# Altium project 微断从V2.0.PrjPcb
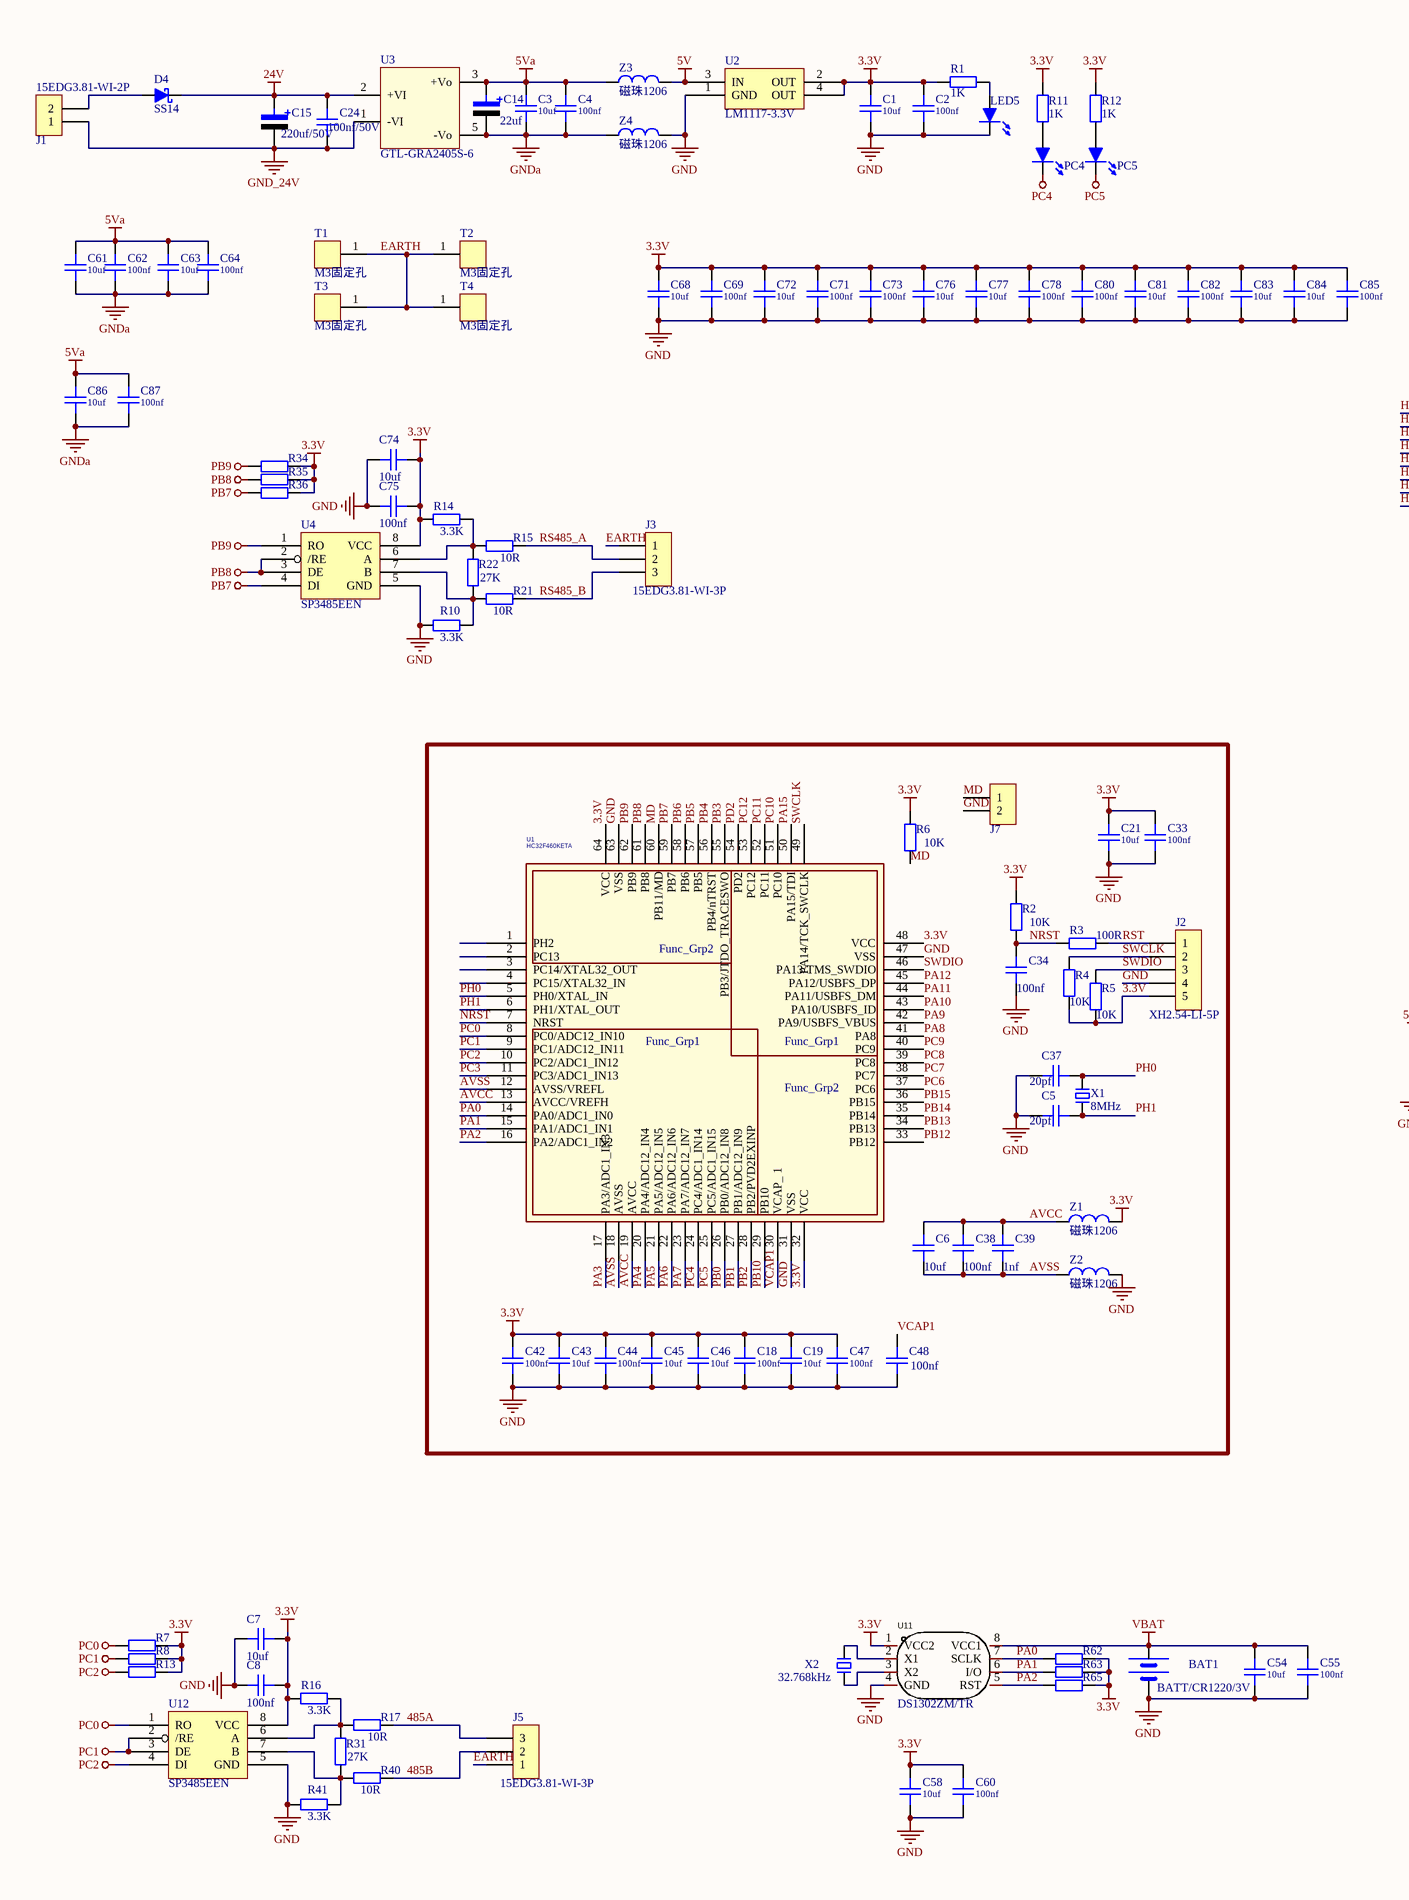
[diagram p0: 微断从V2.0.SchDoc, left]
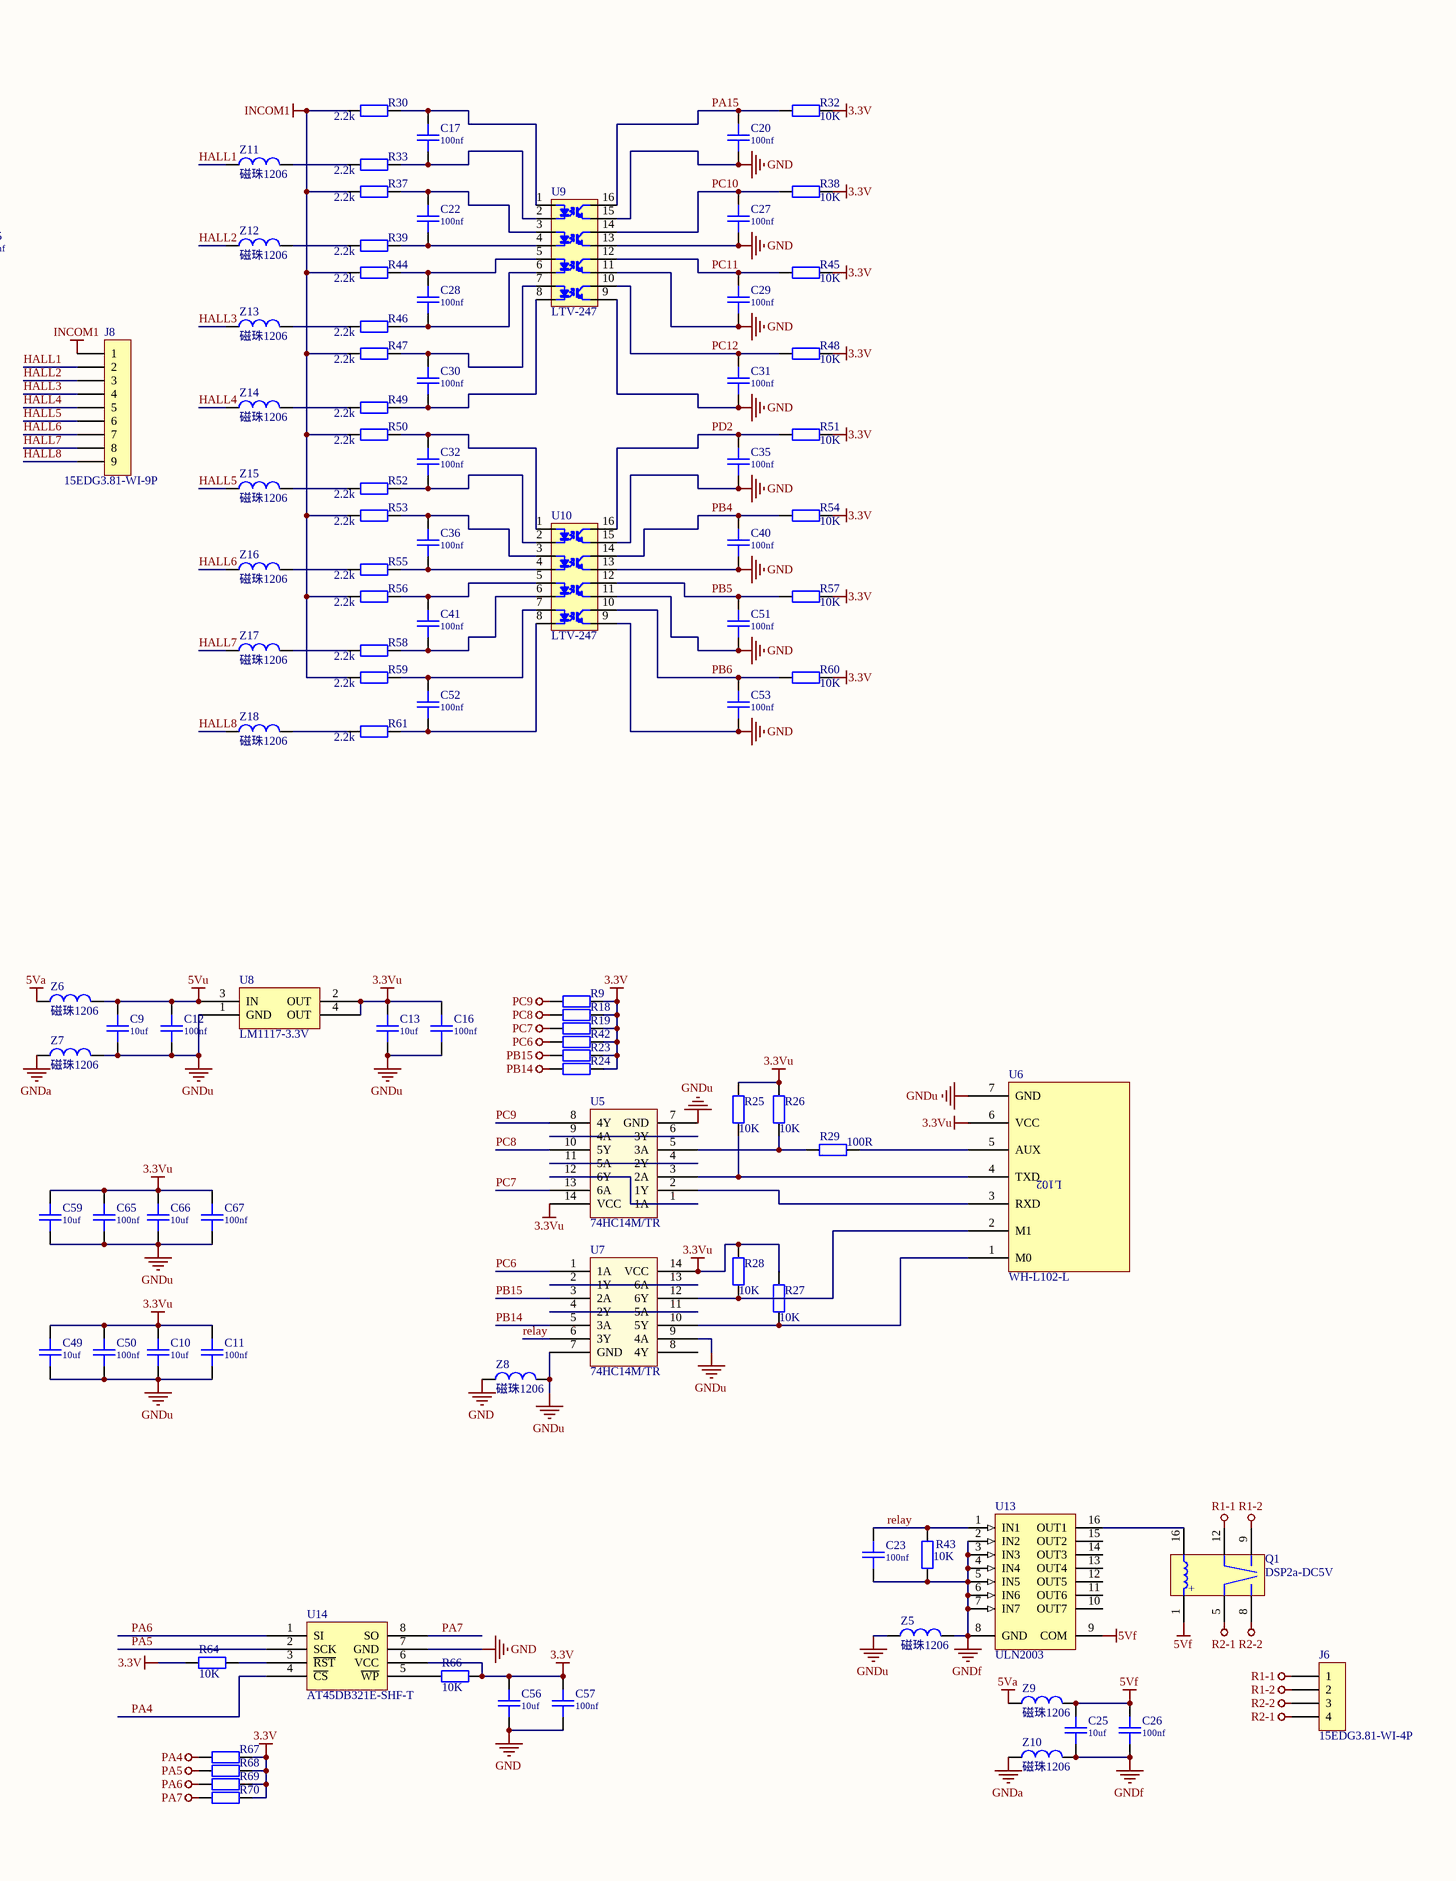
[diagram p1: 微断从V2.0.SchDoc, right]
1 sheet, 205 parts. Net scope: global (net labels, ports and power ports of the same name join across sheets).
Board file: 微断从V2.0.PcbDoc

## Sheet 微断从V2.0.SchDoc
size A2

### Parts
BAT1  BATT/CR1220/3V  [CR1220_A]
C1  10uf  [0805-C]
C2  100nf  [0603-C]
C3  10uf  [0805-C]
C4  100nf  [0603-C]
C5  20pf  [0603-C]
C6  10uf  [0805-C]
C7  10uf  [0805-C]
C8  100nf  [0603-C]
C9  10uf  [0805-C]
C10  10uf  [0805-C]
C11  100nf  [0603-C]
C12  100nf  [0603-C]
C13  10uf  [0805-C]
C14  22uf  [CD B(3528)]
C15  220uf/50V  [CAP 3.5*8*11.5 - BK]
C16  100nf  [0603-C]
C17  100nf  [0603-C]
C18  100nf  [0603-C]
C19  10uf  [0805-C]
C20  100nf  [0603-C]
C21  10uf  [0805-C]
C22  100nf  [0603-C]
C23  100nf  [0603-C]
C24  100nf/50V  [0603-C]
C25  10uf  [0805-C]
C26  100nf  [0603-C]
C27  100nf  [0603-C]
C28  100nf  [0603-C]
C29  100nf  [0603-C]
C30  100nf  [0603-C]
C31  100nf  [0603-C]
C32  100nf  [0603-C]
C33  100nf  [0603-C]
C34  100nf  [0603-C]
C35  100nf  [0603-C]
C36  100nf  [0603-C]
C37  20pf  [0603-C]
C38  100nf  [0603-C]
C39  1nf  [0603-C]
C40  100nf  [0603-C]
C41  100nf  [0603-C]
C42  100nf  [0603-C]
C43  10uf  [0805-C]
C44  100nf  [0603-C]
C45  10uf  [0805-C]
C46  10uf  [0805-C]
C47  100nf  [0603-C]
C48  100nf  [0603-C]
C49  10uf  [0805-C]
C50  100nf  [0603-C]
C51  100nf  [0603-C]
C52  100nf  [0603-C]
C53  100nf  [0603-C]
C54  10uf  [0805-C]
C55  100nf  [0603-C]
C56  10uf  [0805-C]
C57  100nf  [0603-C]
C58  10uf  [0805-C]
C59  10uf  [0805-C]
C60  100nf  [0603-C]
C61  10uf  [0805-C]
C62  100nf  [0603-C]
C63  10uf  [0805-C]
C64  100nf  [0603-C]
C65  100nf  [0603-C]
C66  10uf  [0805-C]
C67  100nf  [0603-C]
C68  10uf  [0805-C]
C69  100nf  [0603-C]
C71  100nf  [0603-C]
C72  10uf  [0805-C]
C73  100nf  [0603-C]
C74  10uf  [0805-C]
C75  100nf  [0603-C]
C76  10uf  [0805-C]
C77  10uf  [0805-C]
C78  100nf  [0603-C]
C80  100nf  [0603-C]
C81  10uf  [0805-C]
C82  100nf  [0603-C]
C83  10uf  [0805-C]
C84  10uf  [0805-C]
C85  100nf  [0603-C]
C86  10uf  [0805-C]
C87  100nf  [0603-C]
D4  SS14  [SMA/DO-214AC]
J1  15EDG3.81-WI-2P  [15EDG3.81-WI-2P]
J2  XH2.54-LI-5P  [XH2.54-LI-5P]
J3  15EDG3.81-WI-3P  [15EDG3.81-WI-3P]
J5  15EDG3.81-WI-3P  [15EDG3.81-WI-3P]
J6  15EDG3.81-WI-4P  [15EDG3.81-WI-4P]
J7  排针1*2P  [HDR2X1_A]  (value not drawn)
J8  15EDG3.81-WI-9P  [15EDG3.81-WI-9P]
LED5  LED0603,黄绿  [0603-LED-G]  (value not drawn)
PC4  LED0603,黄绿  [0603-LED-G]  (value not drawn)
PC5  LED0603,黄绿  [0603-LED-G]  (value not drawn)
Q1  DSP2a-DC5V  [DSP2a-DC5V]
R1  1K  [0603-R]
R2  10K  [0603-R]
R3  100R  [0603-R]
R4  10K  [0603-R]
R5  10K  [0603-R]
R6  10K  [0603-R]
R7  10K  [0603-R]  (value not drawn)
R8  10K  [0603-R]  (value not drawn)
R9  10K  [0603-R]  (value not drawn)
R10  3.3K  [0603-R]
R11  1K  [0603-R]
R12  1K  [0603-R]
R13  10K  [0603-R]  (value not drawn)
R14  3.3K  [0603-R]
R15  10R  [0603-R]
R16  3.3K  [0603-R]
R17  10R  [0603-R]
R18  10K  [0603-R]  (value not drawn)
R19  10K  [0603-R]  (value not drawn)
R21  10R  [0603-R]
R22  27K  [0603-R]
R23  10K  [0603-R]  (value not drawn)
R24  10K  [0603-R]  (value not drawn)
R25  10K  [0603-R]
R26  10K  [0603-R]
R27  10K  [0603-R]
R28  10K  [0603-R]
R29  100R  [0603-R]
R30  2.2k  [0603-R]
R31  27K  [0603-R]
R32  10K  [0603-R]
R33  2.2k  [0603-R]
R34  10K  [0603-R]  (value not drawn)
R35  10K  [0603-R]  (value not drawn)
R36  10K  [0603-R]  (value not drawn)
R37  2.2k  [0603-R]
R38  10K  [0603-R]
R39  2.2k  [0603-R]
R40  10R  [0603-R]
R41  3.3K  [0603-R]
R42  10K  [0603-R]  (value not drawn)
R43  10K  [0603-R]
R44  2.2k  [0603-R]
R45  10K  [0603-R]
R46  2.2k  [0603-R]
R47  2.2k  [0603-R]
R48  10K  [0603-R]
R49  2.2k  [0603-R]
R50  2.2k  [0603-R]
R51  10K  [0603-R]
R52  2.2k  [0603-R]
R53  2.2k  [0603-R]
R54  10K  [0603-R]
R55  2.2k  [0603-R]
R56  2.2k  [0603-R]
R57  10K  [0603-R]
R58  2.2k  [0603-R]
R59  2.2k  [0603-R]
R60  10K  [0603-R]
R61  2.2k  [0603-R]
R62  10K  [0603-R]  (value not drawn)
R63  10K  [0603-R]  (value not drawn)
R64  10K  [0603-R]
R65  10K  [0603-R]  (value not drawn)
R66  10K  [0603-R]
R67  10K  [0603-R]  (value not drawn)
R68  10K  [0603-R]  (value not drawn)
R69  10K  [0603-R]  (value not drawn)
R70  10K  [0603-R]  (value not drawn)
T1  M3固定孔  [M3_N]
T2  M3固定孔  [M3_N]
T3  M3固定孔  [M3_N]
T4  M3固定孔  [M3_N]
U1  HC32F460KETA  [LQFP-64]
U2  LM1117-3.3V  [SOT223]
U3  GTL-GRA2405S-6  [GTL-GRA]
U4  SP3485EEN  [SOIC-8]
U5  74HC14M/TR  [SOIC-14]
U6  WH-L102-L  [WH-L102-L_Lib_V1.0]
U7  74HC14M/TR  [SOIC-14]
U8  LM1117-3.3V  [SOT223]
U9  LTV-247  [SOIC-16-9.1mm]
U10  LTV-247  [SOIC-16-9.1mm]
U11  DS1302ZM/TR  [SOIC-8]
U12  SP3485EEN  [SOIC-8]
U13  ULN2003  [SOIC-16]
U14  AT45DB321E-SHF-T  [SOIC-8-208mil]
X1  8MHz  [OSC HC-49SMD]
X2  32.768kHz  [OSC HC-49SMD]
Z1  value 磁珠1206  [1206-R-RP]  (hidden comment: 磁珠1206/SCBG321609U600T)
Z2  value 磁珠1206  [1206-R-RP]  (hidden comment: 磁珠1206/SCBG321609U600T)
Z3  value 磁珠1206  [1206-R-RP]  (hidden comment: 磁珠1206/SCBG321609U600T)
Z4  value 磁珠1206  [1206-R-RP]  (hidden comment: 磁珠1206/SCBG321609U600T)
Z5  value 磁珠1206  [1206-R-RP]  (hidden comment: 磁珠1206/SCBG321609U600T)
Z6  value 磁珠1206  [1206-R-RP]  (hidden comment: 磁珠1206/SCBG321609U600T)
Z7  value 磁珠1206  [1206-R-RP]  (hidden comment: 磁珠1206/SCBG321609U600T)
Z8  value 磁珠1206  [1206-R-RP]  (hidden comment: 磁珠1206/SCBG321609U600T)
Z9  value 磁珠1206  [1206-R-RP]  (hidden comment: 磁珠1206/SCBG321609U600T)
Z10  value 磁珠1206  [1206-R-RP]  (hidden comment: 磁珠1206/SCBG321609U600T)
Z11  value 磁珠1206  [1206-R-RP]  (hidden comment: 磁珠1206/SCBG321609U600T)
Z12  value 磁珠1206  [1206-R-RP]  (hidden comment: 磁珠1206/SCBG321609U600T)
Z13  value 磁珠1206  [1206-R-RP]  (hidden comment: 磁珠1206/SCBG321609U600T)
Z14  value 磁珠1206  [1206-R-RP]  (hidden comment: 磁珠1206/SCBG321609U600T)
Z15  value 磁珠1206  [1206-R-RP]  (hidden comment: 磁珠1206/SCBG321609U600T)
Z16  value 磁珠1206  [1206-R-RP]  (hidden comment: 磁珠1206/SCBG321609U600T)
Z17  value 磁珠1206  [1206-R-RP]  (hidden comment: 磁珠1206/SCBG321609U600T)
Z18  value 磁珠1206  [1206-R-RP]  (hidden comment: 磁珠1206/SCBG321609U600T)

### Blocks framed on the sheet
Func_Grp1: U1

### Nets
3.3V: C1.1 C2.1 C7.1 C8.1 C18.1 C19.1 C21.1 C33.1 C42.1 C43.1 C44.1 C45.1 C46.1 C47.1 C56.1 C57.1 C58.1 C60.1 C68.1 C69.2 C71.1 C72.1 C73.2 C74.1 C75.1 C76.2 C77.2 C78.2 C80.1 C81.1 C82.1 C83.1 C84.1 C85.1 J2.5 R1.2 R2.2 R4.1 R5.1 R6.2 R7.1 R8.1 R9.1 R11.2 R12.2 R13.1 R14.1 R16.1 R18.1 R19.1 R23.1 R24.1 R32.1 R34.1 R35.1 R36.1 R38.1 R42.1 R45.1 R48.1 R51.1 R54.1 R57.1 R60.1 R62.1 R63.1 R64.2 R65.1 R66.1 R67.1 R68.1 R69.1 R70.1 U1.32(VCC) U1.48(VCC) U1.64(VCC) U2.2(OUT) U2.4(OUT) U4.8(VCC) U11.1(VCC2) U12.8(VCC) U14.6(VCC) Z1.2
3.3Vu: C10.1 C11.1 C13.1 C16.1 C49.1 C50.1 C59.1 C65.1 C66.1 C67.1 R25.2 R26.2 R27.2 R28.2 U5.14(VCC) U6.6(VCC) U7.14(VCC) U8.2(OUT) U8.4(OUT)
5V: U2.3(IN) Z3.2
5Va: C3.1 C4.1 C14.1 C61.1 C62.1 C63.1 C64.1 C86.2 C87.2 U3.3(+Vo) Z3.1 Z6.1 Z9.1
5Vf: C25.1 C26.1 Q1.1 U13.9(COM) Z9.2
5Vu: C9.1 C12.1 U8.3(IN) Z6.2
24V: C15.1 C24.1 D4.2(K) U3.2(+VI)
GND: BAT1.2(GND) C1.2 C2.2 C5.1 C7.2 C8.2 C18.2 C19.2 C20.1 C21.2 C27.1 C29.1 C31.1 C33.2 C34.2 C35.1 C37.1 C40.1 C42.2 C43.2 C44.2 C45.2 C46.2 C47.2 C48.2 C51.1 C53.1 C54.2 C55.2 C56.2 C57.2 C58.2 C60.2 C68.2 C69.1 C71.2 C72.2 C73.1 C74.2 C75.2 C76.1 C77.1 C78.1 C80.2 C81.2 C82.2 C83.2 C84.2 C85.2 J2.4 J7.2 LED5.2(K) R10.2 R41.2 U1.31(VSS) U1.47(VSS) U1.63(VSS) U2.1(GND) U4.5(GND) U9.9(GND) U9.11(GND) U9.13(GND) U9.15(GND) U10.9(GND) U10.11(GND) U10.13(GND) U10.15(GND) U11.4(GND) U12.5(GND) U14.7(GND) Z2.2 Z4.2 Z8.1
GND_24V: C15.2 C24.2 J1.1 U3.1(-VI)
GNDa: C3.2 C4.2 C14.2 C61.2 C62.2 C63.2 C64.2 C86.1 C87.1 U3.5(-Vo) Z4.1 Z7.1 Z10.1
GNDf: C23.2 C25.2 C26.2 R43.2 U13.2(IN2) U13.3(IN3) U13.4(IN4) U13.5(IN5) U13.6(IN6) U13.7(IN7) U13.8(GND) Z5.2 Z10.2
GNDu: C9.2 C10.2 C11.2 C12.2 C13.2 C16.2 C49.2 C50.2 C59.2 C65.2 C66.2 C67.2 U5.7(GND) U6.7(GND) U7.7(GND) U7.9(4A) U8.1(GND) Z5.1 Z7.2 Z8.2
INCOM1: J8.1 R30.2 R37.2 R44.2 R47.2 R50.2 R53.2 R56.2 R59.2
PA4: R67.2 U1.20(PA4/ADC12_IN4) U14.4(~{CS})
PA5: R68.2 U1.21(PA5/ADC12_IN5) U14.2(SCK)
PA6: R69.2 U1.22(PA6/ADC12_IN6) U14.1(SI)
PA7: R70.2 U1.23(PA7/ADC12_IN7) U14.8(SO)
PB7: R36.2 U1.59(PB7) U4.4(DI)
PB8: R35.2 U1.61(PB8) U4.2(/RE) U4.3(DE)
PB9: R34.2 U1.62(PB9) U4.1(RO)
PB14: R24.2 U1.35(PB14) U7.5(3A)
PB15: R23.2 U1.36(PB15) U7.3(2A)
PC0: R7.2 U1.8(PC0/ADC12_IN10) U12.1(RO)
PC1: R8.2 U1.9(PC1/ADC12_IN11) U12.2(/RE) U12.3(DE)
PC2: R13.2 U1.10(PC2/ADC1_IN12) U12.4(DI)
PC4: PC4.2(K) U1.24(PC4/ADC1_IN14)
PC5: PC5.2(K) U1.25(PC5/ADC1_IN15)
PC6: R42.2 U1.37(PC6) U7.1(1A)
PC7: R19.2 U1.38(PC7) U5.13(6A)
PC8: R18.2 U1.39(PC8) U5.10(5Y)
PC9: R9.2 U1.40(PC9) U5.8(4Y)
R1-1: J6.1 Q1.12
R1-2: J6.2 Q1.9
R2-1: J6.4 Q1.5
R2-2: J6.3 Q1.8
VBAT: BAT1.1(VCC) C54.1 C55.1 U11.8(VCC1)
485A: J5.3 R17.1
485B: J5.2 R40.1
AVCC: C6.1 C38.1 C39.1 U1.13(AVCC/VREFH) U1.19(AVCC) Z1.1
AVSS: C6.2 C38.2 C39.2 U1.12(AVSS/VREFL) U1.18(AVSS) Z2.1
EARTH: J3.1 J5.1 T1.1(PG) T2.1(PG) T3.1(PG) T4.1(PG)
HALL1: J8.2 Z11.1
HALL2: J8.3 Z12.1
HALL3: J8.4 Z13.1
HALL4: J8.5 Z14.1
HALL5: J8.6 Z15.1
HALL6: J8.7 Z16.1
HALL7: J8.8 Z17.1
HALL8: J8.9 Z18.1
MD: J7.1 R6.1 U1.60(PB11/MD)
NRST: C34.1 R2.1 R3.2 U1.7(NRST)
PA0: R62.2 U1.14(PA0/ADC1_IN0) U11.7(SCLK)
PA1: R63.2 U1.15(PA1/ADC1_IN1) U11.6(I/O)
PA2: R65.2 U1.16(PA2/ADC1_IN2) U11.5(RST)
PA3: U1.17(PA3/ADC1_IN3)
PA8: U1.41(PA8)
PA9: U1.42(PA9/USBFS_VBUS)
PA10: U1.43(PA10/USBFS_ID)
PA11: U1.44(PA11/USBFS_DM)
PA12: U1.45(PA12/USBFS_DP)
PA15: C20.2 R32.2 U1.50(PA15/TDI) U9.16(OUT)
PB0: U1.26(PB0/ADC12_IN8)
PB1: U1.27(PB1/ADC12_IN9)
PB2: U1.28(PB2/PVD2EXINP)
PB3: U1.55(PB3/JTDO_TRACESWO)
PB4: C40.2 R54.2 U1.56(PB4/nTRST) U10.14(OUT)
PB5: C51.2 R57.2 U1.57(PB5) U10.12(OUT)
PB6: C53.2 R60.2 U1.58(PB6) U10.10(OUT)
PB10: U1.29(PB10)
PB12: U1.33(PB12)
PB13: U1.34(PB13)
PC3: U1.11(PC3/ADC1_IN13)
PC10: C27.2 R38.2 U1.51(PC10) U9.14(OUT)
PC11: C29.2 R45.2 U1.52(PC11) U9.12(OUT)
PC12: C31.2 R48.2 U1.53(PC12) U9.10(OUT)
PD2: C35.2 R51.2 U1.54(PD2) U10.16(OUT)
PH0: C37.2 U1.5(PH0/XTAL_IN) X1.2
PH1: C5.2 U1.6(PH1/XTAL_OUT) X1.1
relay: C23.1 R43.1 U7.6(3Y) U13.1(IN1)
RS485_A: J3.2 R15.1
RS485_B: J3.3 R21.1
RST: J2.1 R3.1
SWCLK: J2.2 R4.2 U1.49(PA14/TCK_SWCLK)
SWDIO: J2.3 R5.2 U1.46(PA13/TMS_SWDIO)
VCAP1: C48.1 U1.30(VCAP__1)
NetC17_1: C17.1 R30.1 U9.1(A)
NetC17_2: C17.2 R33.1 U9.2(K)
NetC22_1: C22.1 R37.1 U9.3(A)
NetC22_2: C22.2 R39.1 U9.4(K)
NetC28_1: C28.1 R44.1 U9.5(A)
NetC28_2: C28.2 R46.1 U9.6(K)
NetC30_1: C30.1 R47.1 U9.7(A)
NetC30_2: C30.2 R49.1 U9.8(K)
NetC32_1: C32.1 R50.1 U10.1(A)
NetC32_2: C32.2 R52.1 U10.2(K)
NetC36_1: C36.1 R53.1 U10.3(A)
NetC36_2: C36.2 R55.1 U10.4(K)
NetC41_1: C41.1 R56.1 U10.5(A)
NetC41_2: C41.2 R58.1 U10.6(K)
NetC52_1: C52.1 R59.1 U10.7(A)
NetC52_2: C52.2 R61.1 U10.8(K)
NetD4_1: D4.1(A) J1.2
NetLED5_1: LED5.1(A) R1.1
NetPC4_1: PC4.1(A) R11.1
NetPC5_1: PC5.1(A) R12.1
NetQ1_16: Q1.16 U13.16(OUT1)
NetR10_1: R10.1 R21.2 R22.1 U4.7(B)
NetR14_2: R14.2 R15.2 R22.2 U4.6(A)
NetR16_2: R16.2 R17.2 R31.2 U12.6(A)
NetR25_1: R25.1 U5.3(2A) U6.4(TXD)
NetR26_1: R26.1 R29.2 U5.5(3A)
NetR27_1: R27.1 U6.1(M0) U7.10(5Y)
NetR28_1: R28.1 U6.2(M1) U7.12(6Y)
NetR29_1: R29.1 U6.5(AUX)
NetR31_1: R31.1 R40.2 R41.1 U12.7(B)
NetR33_2: R33.2 Z11.2
NetR39_2: R39.2 Z12.2
NetR46_2: R46.2 Z13.2
NetR49_2: R49.2 Z14.2
NetR52_2: R52.2 Z15.2
NetR55_2: R55.2 Z16.2
NetR58_2: R58.2 Z17.2
NetR61_2: R61.2 Z18.2
NetR64_1: R64.1 U14.3(~{RST})
NetR66_2: R66.2 U14.5(~{WP})
NetU5_1: U5.1(1A) U5.12(6Y)
NetU5_2: U5.2(1Y) U6.3(RXD)
NetU5_4: U5.4(2Y) U5.11(5A)
NetU5_6: U5.6(3Y) U5.9(4A)
NetU7_2: U7.2(1Y) U7.13(6A)
NetU7_4: U7.4(2Y) U7.11(5A)
NetU11_2: U11.2(X1) X2.2
NetU11_3: U11.3(X2) X2.1

Not connected (* = marked no-connect by the designer): U1 1(PH2) 2(PC13) 3(PC14/XTAL32_OUT) 4(PC15/XTAL32_IN); U7 8(4Y); U13 10(OUT7) 11(OUT6) 12(OUT5) 13(OUT4) 14(OUT3) 15(OUT2)

### Notes on the sheet
- (near U1) Func_Grp2
- (near U1) Func_Grp1
- (in symbol DSP2a-DC5V) +
- (in symbol WH-L102-L) L102

### Library data of the parts
BAT1 = BAT: CR1220/3V电池及座
C1-C4 C6-C13 C16-C36 C38 C40-C69 C71-C78 C80-C87 = Cap-S: 贴片瓷片电容; Published: 8-Jun-2000; LatestRevisionDate: 17-Jul-2002; LatestRevisionNote: Re-released for DXP Platform.; PackageReference: RAD-0.3; Publisher: Altium Limited
  C1 C3 C6 C7 C9 C10 C13 C19 C21 C25 C43 C45 C46 C49 C54 C56 C58 C59 C61 C63 C66 C68 C72 C74 C76 C77 C81 C83 C84 C86: value: 10uf
  C2 C4 C8 C11 C12 C16-C18 C20 C22 C23 C26-C36 C38 C40-C42 C44 C47 C48 C50-C53 C55 C57 C60 C62 C64 C65 C67 C69 C71 C73 C75 C78 C80 C82 C85 C87: value: 100nf
  C24: value: 100nf/50V
C5 C37 C39 = Cap-S: 贴片瓷片电容; value: 100nf; Published: 8-Jun-2000; LatestRevisionDate: 17-Jul-2002; LatestRevisionNote: Re-released for DXP Platform.; PackageReference: RAD-0.3; Publisher: Altium Limited
C14 = Cap-Pol-ER: 插件电解电容; Vol: 20V; Published: 8-Jun-2000; LatestRevisionDate: 17-Jul-2002; LatestRevisionNote: Re-released for DXP Platform.; PackageReference: RB7.6-15; Publisher: Altium Limited; Value: 22uF
C15 = Cap-Pol-ER: 插件电解电容; Value: 1000uF; Vol: 25V; Published: 8-Jun-2000; LatestRevisionDate: 17-Jul-2002; LatestRevisionNote: Re-released for DXP Platform.; PackageReference: RB7.6-15; Publisher: Altium Limited
D4 = Diode2: 肖特基二极管; Published: 8-Jun-2000; LatestRevisionDate: 17-Jul-2002; LatestRevisionNote: Re-released for DXP Platform.; PackageDocument: Sep-1996; PackageReference: SMC; Publisher: Altium Limited; Code_JEDEC: DO-214-AB
J1 J7 = Header 2: 接插件; LatestRevisionDate: 17-Jul-2002; LatestRevisionNote: Re-released for DXP Platform.; Publisher: Altium Limited
J2 = Header 5: 接插件; LatestRevisionDate: 17-Jul-2002; LatestRevisionNote: Re-released for DXP Platform.; Publisher: Altium Limited
J3 J5 = Header 3: 接插件; LatestRevisionDate: 17-Jul-2002; LatestRevisionNote: Re-released for DXP Platform.; Publisher: Altium Limited
J6 = Header 4: 接插件; LatestRevisionDate: 17-Jul-2002; LatestRevisionNote: Re-released for DXP Platform.; Publisher: Altium Limited
J8 = Header 9: Header, 9-Pin; LatestRevisionDate: 17-Jul-2002; LatestRevisionNote: Re-released for DXP Platform.; Publisher: Altium Limited
LED5 PC4 PC5 = LED: 发光二极管; Published: 8-Jun-2000; LatestRevisionDate: 08-Jul-2005; LatestRevisionNote: Mech Layer 1 removed.; PackageReference: LED-0; Publisher: Altium Limited
Q1 = DSP2a-DC5V: 松下继电器
R1 R7 R8 R11-R13 R30 R33-R37 R39 R44 R46 R47 R49 R50 R52 R53 R55 R56 R58 R59 R61 R67-R70 = Res1: 贴片电阻; Published: 8-Jun-2000; LatestRevisionDate: 17-Jul-2002; LatestRevisionNote: Re-released for DXP Platform.; PackageReference: AXIAL-0.4; Publisher: Altium Limited
  R1 R11 R12: Value: 1K
  R7 R8 R13 R34-R36 R67-R70: Value: 10K
  R30 R33 R37 R39 R44 R46 R47 R49 R50 R52 R53 R55 R56 R58 R59 R61: Value: 2.2K
R2-R6 R9 R18 R19 R23-R29 R32 R38 R42 R43 R45 R48 R51 R54 R57 R60 R62-R66 = Res1: 贴片电阻; Value: 2.2K; Published: 8-Jun-2000; LatestRevisionDate: 17-Jul-2002; LatestRevisionNote: Re-released for DXP Platform.; PackageReference: AXIAL-0.4; Publisher: Altium Limited
R10 R14-R17 R21 R40 R41 = Res2: Resistor; Published: 8-Jun-2000; LatestRevisionDate: 17-Jul-2002; LatestRevisionNote: Re-released for DXP Platform.; PackageReference: AXIAL-0.4; Publisher: Altium Limited
  R10 R14 R16 R41: Value: 3.3K
  R15 R17 R21 R40: Value: 10R
R22 R31 = Res2: Resistor; Value: 24K; Published: 8-Jun-2000; LatestRevisionDate: 17-Jul-2002; LatestRevisionNote: Re-released for DXP Platform.; PackageReference: AXIAL-0.4; Publisher: Altium Limited
T1-T4 = something_1: 自选封装
U2 U8 = AMS1117: 3.3V稳压芯片
U3 = GTL-GRA: 冠图电子电源模块
U4 U12 = MAX3082
U5 U7 = 74HC14: 反相器
U9 U10 = TLP521_4: 光耦; Published: 24-Mar-1999; LatestRevisionDate: 04-Mar-2005; LatestRevisionNote: Sch pins 3 & 4 Swapped.; DatasheetDocument: Nov-2003; PackageReference: DIP-4; Publisher: Altium Limited
U11 = DS1302ZM/TR: Manufacturer: HGSEMI(华冠); Add into BOM: yes; Symbol: DS1302ZM; Device: DS1302ZM/TR; LCSC Part Name: DS1302ZM/TR; Supplier Part: C910859; Manufacturer Part: DS1302ZM/TR; Supplier Footprint: SOP-8; JLCPCB Part Class: Extended Part; Datasheet: https://atta.szlcsc.com/upload/public/pdf/source/20201111/C910859_921CCC6706070F058354C83BA711E7C3.pdf; Supplier: LCSC; Convert to PCB: yes
U14 = AT45DB642D: 封装: SO8-W; 型号: AT45DB642D
X1 X2 = XTAL-2P: 2脚无源脚晶振; 版权归属: 源创客; BOM名称: 2脚无源脚晶振; 学习资源: www.ooocke.com
Z1-Z18 = Inductor: 电感; Code_IEC: 1005; Published: 8-Jun-2000; LatestRevisionDate: 17-Jul-2002; LatestRevisionNote: Re-released for DXP Platform.; PackageReference: 0402-A; Publisher: Altium Limited; Code_JEITA: 0402